# Altium schematic sheet ESP32_SCH.SchDoc
size A4; SheetNumber: 1; SheetTotal: 1
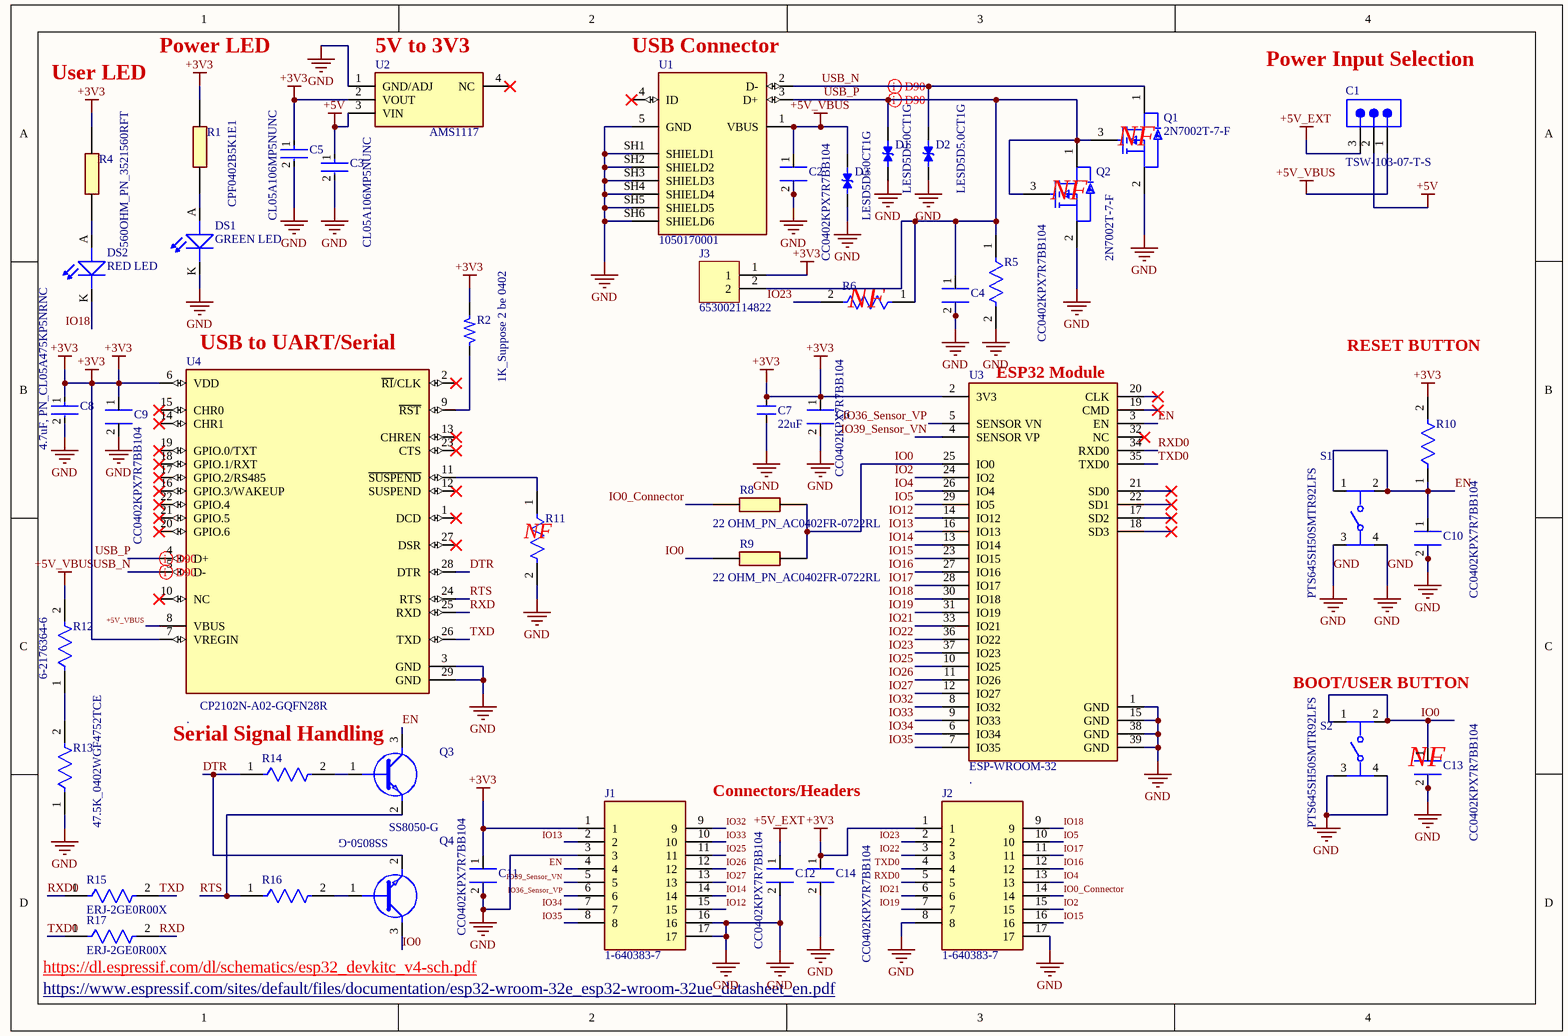
[diagram p0: ESP32_SCH.SchDoc]

## Parts
C1  TSW-103-07-T-S  [x3Pins_CONN_SMTC-TSW-103-07-x-s]
C2  CC0402KPX7R7BB104  [Yageo_CC0402KPX]
C3  CL05A106MP5NUNC  [SAMSUNG_CAP_10uF_0402]
C4  CC0402KPX7R7BB104  [Yageo_CC0402KPX]
C5  CL05A106MP5NUNC  [SAMSUNG_CAP_10uF_0402]
C6  CC0402KPX7R7BB104  [Yageo_CC0402KPX]
C7  22uF  [CAP_0805]
C8  4.7uF, PN_CL05A475KP5NRNC  [SAMSUNG_CAP_10uF_0402]
C9  CC0402KPX7R7BB104  [Yageo_CC0402KPX]
C10  CC0402KPX7R7BB104  [Yageo_CC0402KPX]
C11  CC0402KPX7R7BB104  [Yageo_CC0402KPX]
C12  CC0402KPX7R7BB104  [Yageo_CC0402KPX]
C13  CC0402KPX7R7BB104  [Yageo_CC0402KPX]
C14  CC0402KPX7R7BB104  [Yageo_CC0402KPX]
D1  LESD5D5.0CT1G  [LESD5D5.0CT1G]
D2  LESD5D5.0CT1G  [LESD5D5.0CT1G]
D3  LESD5D5.0CT1G  [LESD5D5.0CT1G]
DS1  GREEN LED  [LED_0805]
DS2  RED LED  [LED_0805]
J1  1-640383-7  [TE_17Pin_HDR]
J2  1-640383-7  [TE_17Pin_HDR]
J3  653002114822  [CON2_50_653002114822_TH_ST]
Q1  2N7002T-7-F  [2N7002T-7-F]
Q2  2N7002T-7-F  [2N7002T-7-F]
Q3  SS8050-G  [BJT_NPN_SS8050-G]  (value not drawn)
Q4  SS8050-G  [BJT_NPN_SS8050-G]  (value not drawn)
R1  CPF0402B5K1E1  [TE_Connectivity_5.1K_0402]
R2  1K_Suppose 2 be 0402  [RES_0603]
R4  560OHM_PN_3521560RFT  [TE_Connectivity_5.1K_0402]
R5  CRGCQ0402J10K  [TE_Connectivity_10K_0402]  (value not drawn)
R6  CRGCQ0402J10K  [TE_Connectivity_10K_0402]  (value not drawn)
R8  22 OHM_PN_AC0402FR-0722RL  [TE_Connectivity_5.1K_0402]
R9  22 OHM_PN_AC0402FR-0722RL  [TE_Connectivity_5.1K_0402]
R10  CRGCQ0402J10K  [TE_Connectivity_10K_0402]  (value not drawn)
R11  NF  [TE_Connectivity_10K_0402]
R12  6-2176364-6  [TE_Connectivity_22.1K_0402]
R13  47.5K_0402WGF4752TCE  [TE_Connectivity_22.1K_0402]
R14  CRGCQ0402J10K  [TE_Connectivity_10K_0402]  (value not drawn)
R15  ERJ-2GE0R00X  [PANASONIC_0_OHM_0402]
R16  CRGCQ0402J10K  [TE_Connectivity_10K_0402]  (value not drawn)
R17  ERJ-2GE0R00X  [PANASONIC_0_OHM_0402]
S1  PTS645SH50SMTR92LFS  [C&K Tactile SW]
S2  PTS645SH50SMTR92LFS  [C&K Tactile SW]
U1  1050170001  [MOLEX_1050170001]
U2  AMS1117  [ASM1117-3V3_SOT229P700X180-4N]
U3  .  [ESP-WROOM-32]
U4  .  [CP21002N-A02]

## Nets
+3V3: C5.1 C6.1 C7.2 C8.1 C9.1 C11.1 C14.1 J1.1 J2.1 J3.1 R1.1 R2.2 R4.2 R10.2 U2.2(VOUT) U3.2(3V3) U4.6(VDD) U4.7(VREGIN)
+5V: C1.2 C3.1 U2.3(VIN)
+5V_EXT: C1.3 C12.1
+5V_VBUS: C1.1 C2.1 D3.2 R12.2 U1.1(VBUS) U4.8(VBUS)
GND: C2.2 C3.2 C4.2 C5.2 C6.2 C7.1 C8.2 C9.2 C10.2 C11.2 C12.2 C13.2 C14.2 D1.1 D2.1 D3.1 DS1.K(CATHODE) J1.3 J1.16 J1.17 J2.8 J2.17 Q1.2(Gate) Q2.2(Gate) R5.2 R11.2 R13.1 S1.3 S1.4 S2.3 S2.4 U1.5(GND) U1.SH1(SHIELD1) U1.SH2(SHIELD2) U1.SH3(SHIELD3) U1.SH4(SHIELD4) U1.SH5(SHIELD5) U1.SH6(SHIELD6) U2.1(GND/ADJ) U3.1(GND) U3.15(GND) U3.38(GND) U3.39(GND) U4.3(GND) U4.29(GND)
DTR: Q4.2(E) R14.1 U4.28(DTR)
EN: C10.1 J1.4 Q3.3(C) R10.1 S1.1 S1.2 U3.3(EN)
IO0: C13.1 Q4.3(C) R8.2 R9.1 R9.2 S2.1 S2.2 U3.25(IO0)
IO0_Connector: J2.14 R8.1
IO2: J2.15 U3.24(IO2)
IO4: J2.13 U3.26(IO4)
IO5: J2.10 U3.29(IO5)
IO12: J1.15 U3.14(IO12)
IO13: J1.2 U3.16(IO13)
IO14: J1.14 U3.13(IO14)
IO15: J2.16 U3.23(IO15)
IO16: J2.12 U3.27(IO16)
IO17: J2.11 U3.28(IO17)
IO18: DS2.K(CATHODE) J2.9 U3.30(IO18)
IO19: J2.7 U3.31(IO19)
IO21: J2.6 U3.33(IO21)
IO22: J2.3 U3.36(IO22)
IO23: J2.2 R6.2 U3.37(IO23)
IO25: J1.11 U3.10(IO25)
IO26: J1.12 U3.11(IO26)
IO27: J1.13 U3.12(IO27)
IO32: J1.9 U3.8(IO32)
IO33: J1.10 U3.9(IO33)
IO34: J1.7 U3.6(IO34)
IO35: J1.8 U3.7(IO35)
IO36_Sensor_VP: J1.6 U3.5(SENSOR_VN)
IO39_Sensor_VN: J1.5 U3.4(SENSOR_VP)
RTS: Q3.2(E) R16.1 U4.24(RTS)
RXD: R17.2 U4.25(RXD)
RXD0: J2.5 R15.1 U3.34(RXD0)
TXD: R15.2 U4.26(TXD)
TXD0: J2.4 R17.1 U3.35(TXD0)
USB_N: D2.2 Q1.1(Drain) U1.2(D-) U4.5(D-)
USB_P: C4.1 D1.2 J3.2 Q1.3(Source) Q2.1(Drain) Q2.3(Source) R5.1 R6.1 U1.3(D+) U4.4(D+)
NetDS1_A: DS1.A(ANODE) R1.2
NetDS2_A: DS2.A(ANODE) R4.1
NetQ3_1: Q3.1(B) R14.2
NetQ4_1: Q4.1(B) R16.2
NetR2_1: R2.1 U4.9(~{RST})
NetR11_1: R11.1 U4.11(~{SUSPEND})
NetR12_1: R12.1 R13.2

Not connected (* = marked no-connect by the designer): U1 4(ID)*; U2 4(NC)*; U3 17(SD2)* 18(SD3)* 19(CMD)* 20(CLK)* 21(SD0)* 22(SD1)* 32(NC)*; U4 1(DCD)* 2(~{RI}/CLK)* 10(NC)* 12(SUSPEND)* 13(CHREN)* 14(CHR1)* 15(CHR0)* 16(GPIO.3/WAKEUP)* 17(GPIO.2/RS485)* 18(GPIO.1/RXT)* 19(GPIO.0/TXT)* 20(GPIO.6)* 21(GPIO.5)* 22(GPIO.4)* 23(CTS)* 27(DSR)*

## Layout directives
differential pair; differential pair class D90: USB_N, USB_P

## Notes on the sheet
- User LED
- Power LED
- (near U2) 5V to 3V3
- (near U1) USB Connector
- Power Input Selection
- (near Q1) NF
- (near Q2) NF
- (near R6) NF
- (near U4) USB to UART/Serial
- (near U3) ESP32 Module
- RESET BUTTON
- (near S2) BOOT/USER BUTTON
- (near Q3) Serial Signal Handling
- (near C13) NF
- (near J1) Connectors/Headers
- https://dl.espressif.com/dl/schematics/esp32_devkitc_v4-sch.pdf
- https://www.espressif.com/sites/default/files/documentation/esp32-wroom-32e_esp32-wroom-32ue_datasheet_en.pdf
- (in symbol IC_CP2102N-A02-GQFN28R) CP2102N-A02-GQFN28R
- (in symbol IC_Espressif_ESP-WROOM-32_eec) ESP-WROOM-32

## Library data of the parts
C1 = HDR_3x_Pins_Male_Board/Board/Cable: 0.025" SQ Post Header, Through-hole, Vertical, -55 to 105 degC, 2.54 mm Pitch, 3-Pin, Male, RoHS
C2 C4 C6 C9-C14 = CAP_100nF_0.1uF_10V_0402: Multilayer Ceramic Capacitor, 0.1 uF, 10 V, ± 10%, X7R, 0402 [1005 Metric]
C3 C5 C8 = CAP_10uF_10V_SMD_0402: Multilayer Ceramic Capacitor, 10 uF, 10 V, ± 20%, X5R, 0402 [1005 Metric]
C7 = CAP_22uF-25V-20%-0805: 22µF ±20% 25V Ceramic Capacitor X5R 0805 (2012 Metric); Manufacturer: Murata; Manufacturer Part Number: GRM21BR61E226ME44L; Alternate Part Number-1: NA; Case/Package: 0805; Supplier-1: LCSC; Supplier Part Number-1: C86816
D1-D3 = DIO_Transient_VOl_Suppressor_ESD_PROTECTION: Transient Voltage Suppressors for ESD Protection
DS1 = LED_GREEN-2.2-20mA-0805: Green 569nm LED Indication - Discrete 2.1V 0805 (2012 Metric); Manufacturer: Vishay Lite-On; Manufacturer Part Number: LTST-C171GKT; Alternate Part Number-1: NA; Case/Package: 0805; Supplier-1: SP ROAD; Supplier Part Number-1: LTST-C171GKT
DS2 = LED_RED-2V-20mA-0805: Red 631nm LED Indication - Discrete 2V 0805 (2012 Metric); Manufacturer: Vishay Lite-On; Manufacturer Part Number: LTST-C171KRKT; Alternate Part Number-1: NA; Case/Package: 0805; Supplier-1: SP ROAD; Supplier Part Number-1: LTST-C171KRKT
J1 J2 = HDR_CON_x17Pin: Conn Unshrouded Header HDR 17 POS 3.96mm Solder ST Thru-Hole Package
J3 = CON-PLG_2X1-50-ST-TH: 2 Pins, 1 Row 1.25mm Pitch, Straight Connector, male; Manufacturer: JST; Mating Part Number: 653002113322; Crimp Part Number: 653153128130; Alternate Part Number-1: NA; Manufacturer Part Number: 653002114822; Case/Package: TH-CON; Supplier-1: WURTH; Supplier Part Number-1: 653002114822
Q1 Q2 = TRN_MOSFET_N-CH_60V_0.115A: Transistor MOSFET N-CH 60V 0.115A 3-Pin SOT-523 T/R - Tape and Reel
Q3 Q4 = BJT_SS8050-G_NPN: Bipolar Transistors - BJT NPN TRANSISTOR 1.5A 40V
R1 R4 R8 R9 = RES_5.1K_0402: Res Thin Film 0402 5.1K Ohm 0.1% 1/16W ±25ppm/°C Molded SMD SMD Paper T/R
R2 = RES_1K-0.1W-1%-0603: 1 kOhms ±1% 0.1W, 1/10W Chip Resistor 0603 (1608 Metric) Automotive AEC-Q200 Thick Film; Manufacturer: Walsin; Manufacturer Part Number: WR06X1001FTL; Alternate Part Number-1: 0603WAF1001T5E; Case/Package: 0603; Supplier-1: SIRICOM; Supplier Part Number-1: WR06X1001FTL
R5 R6 R10 R11 R14 R16 = RES_10K_0402_SMD: SMD Chip Resistor, 10 kOhm, ± 5%, 63 mW, 0402 [1005 Metric], Thick Film, General Purpose
R12 R13 = RES_22.1KOHM_0402: Res Precision Thin Film 22.1kOhm 0.1% 62.5mW 10ppm/°C 2-Pin 0402 SMD T/R
R15 R17 = RES_0_OHM_0402: SMD Chip Resistor, Jumper, 0 ohm, 100 mW, 0402 [1005 Metric], Thick Film, General Purpose
S1 S2 = SW_Tactile_0.05A,12VDC_SMD: Switch Tactile N.O. SPST Round Button Gull Wing 0.05A 12VDC 100000Cycles 1.96N SMD T/R
U1 = USB_Micro_B 2.0_MOLEX: USB - micro B USB 2.0 Receptacle Connector 5 Position Surface Mount, Right Angle; Through Hole
U2 = VREG_1117_1A_LDO: ASM1117, 5V to 3V3, 1A.
U3 = IC_Espressif_ESP-WROOM-32_eec: IC SPRESSIF ESP32 BLUETOOTH WIFI MESP-WROOM-32 is a powerful, generic Wi-Fi+BT+BLE MCU module
U4 = IC_CP2102N-A02-GQFN28R: Integrated Circuit Interface USB for UART Controller; 3-3.6V; -40+85 deg.C; SMD; QFN28